# Altium schematic sheet Vapeix_mini_Shield.SchDoc: Vapeix Mini PCB - Interface
size A3; Organization: Altium Limited; Address1: L3, 12a Rodborough Rd; Address2: Frenchs Forest; Address3: NSW; Address4: Australia 2086; Revision: v2.0
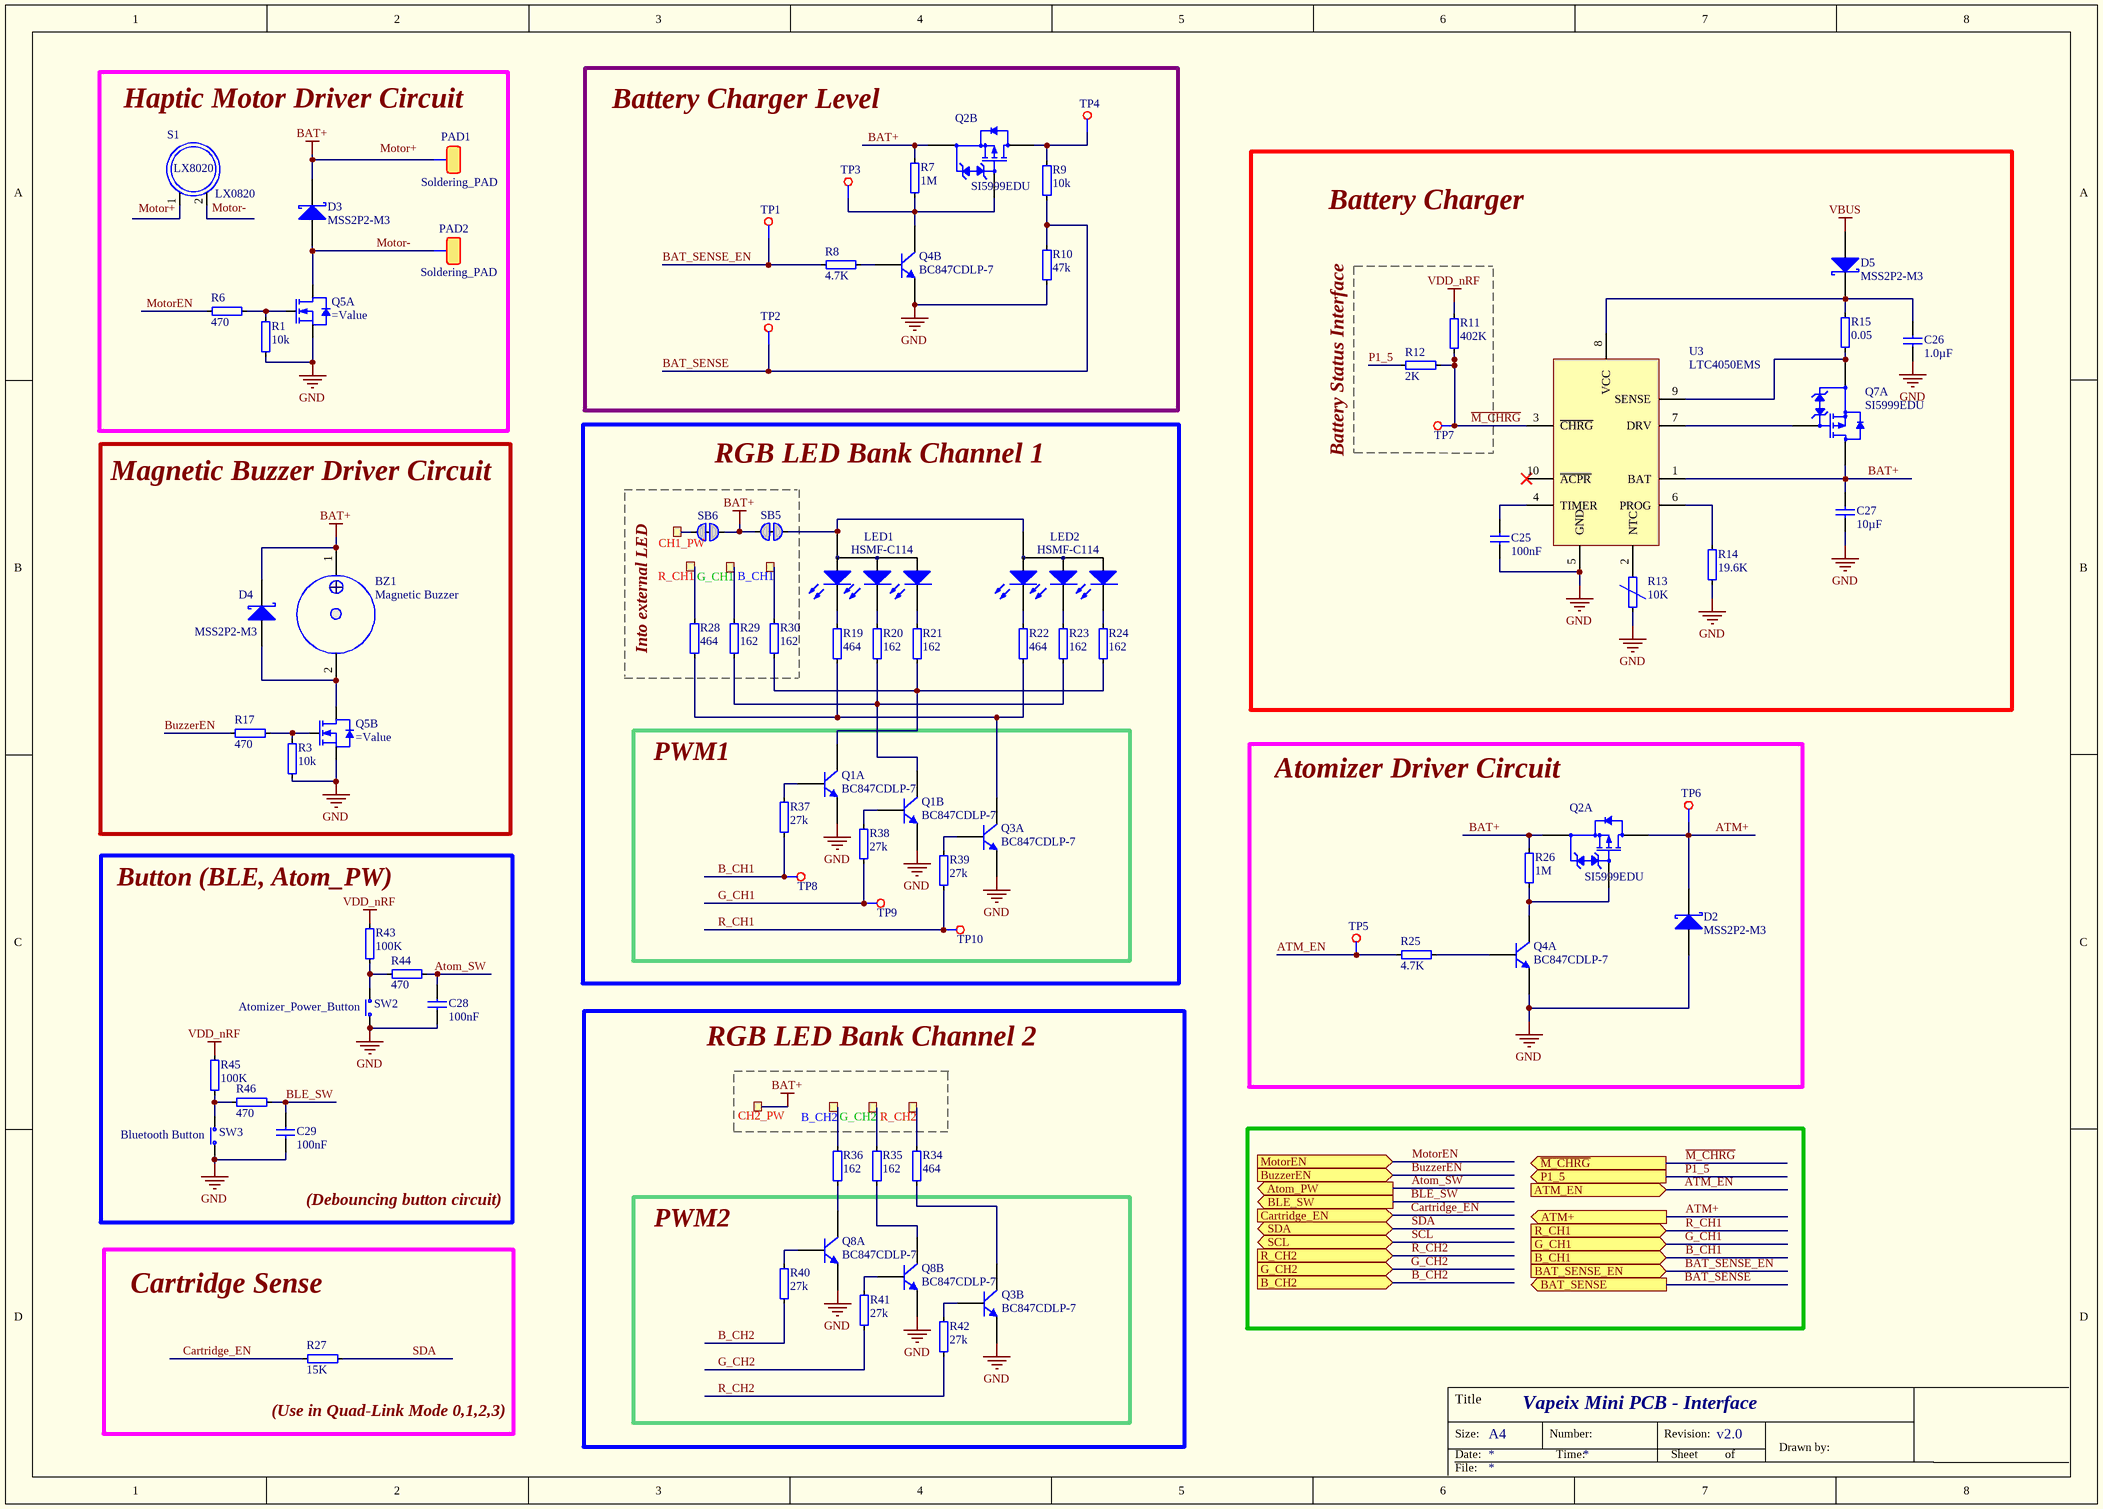
[diagram p0: Vapeix_mini_Shield.SchDoc]

## Parts
B_CH1  TP  [TESTPAD-TH]  (value not drawn)  (no BOM)
B_CH2  TP  [TESTPAD-TH]  (value not drawn)  (no BOM)
BZ1  Magnetic Buzzer  [Magnetic Buzzer]
C25  100nF  [C0201]
C26  1.0µF  [C0201]
C27  10µF  [R0402]
C28  100nF  [C0201]
C29  100nF  [C0201]
CH1_PW  TP  [TESTPAD-TH]  (value not drawn)  (no BOM)
CH2_PW  TP  [TESTPAD-TH]  (value not drawn)  (no BOM)
D2  MSS2P2-M3  [MSS2P2-M3]
D3  MSS2P2-M3  [MSS2P2-M3]
D4  MSS2P2-M3  [MSS2P2-M3]
D5  MSS2P2-M3  [MSS2P2-M3]
G_CH1  TP  [TESTPAD-TH]  (value not drawn)  (no BOM)
G_CH2  TP  [TESTPAD-TH]  (value not drawn)  (no BOM)
LED1  HSMF-C114  [HSMF-C114]
LED2  HSMF-C114  [HSMF-C114]
PAD1  Soldering_PAD  [Soldering_PAD]
PAD2  Soldering_PAD  [Soldering_PAD]
Q1  BC847CDLP-7  [BC847CDLP-7]  (parts A,B of 2)
Q2  SI5999EDU  [SI5999EDU]  (parts A,B of 2)
Q3  BC847CDLP-7  [BC847CDLP-7]  (parts A,B of 2)
Q4  BC847CDLP-7  [BC847CDLP-7]  (parts A,B of 2)
Q5  (no value)  [SOT363]  (parts A,B of 2)
Q7  SI5999EDU  [SI5999EDU]  (part A of 2)
Q8  BC847CDLP-7  [BC847CDLP-7]  (parts A,B of 2)
R1  10k  [R0201]
R3  10k  [R0201]
R6  470  [R0201]
R7  1M  [R0201]
R8  4.7K  [R0201]
R9  10k  [R0201]
R10  47k  [R0201]
R11  402K  [R0201]
R12  2K  [R0201]
R13  10K  [RL0503-5820-97-MS]
R14  19.6K  [R0201]
R15  0.05  [0805]
R17  470  [R0201]
R19  464  [R0201]
R20  162  [R0201]
R21  162  [R0201]
R22  464  [R0201]
R23  162  [R0201]
R24  162  [R0201]
R25  4.7K  [R0201]
R26  1M  [R0201]
R27  15K  [R0201]
R28  464  [R0201]
R29  162  [R0201]
R30  162  [R0201]
R34  464  [R0201]
R35  162  [R0201]
R36  162  [R0201]
R37  27k  [R0201]
R38  27k  [R0201]
R39  27k  [R0201]
R40  27k  [R0201]
R41  27k  [R0201]
R42  27k  [R0201]
R43  100K  [R0201]
R44  470  [R0201]
R45  100K  [R0201]
R46  470  [R0201]
R_CH1  TP  [TESTPAD-TH]  (value not drawn)  (no BOM)
R_CH2  TP  [TESTPAD-TH]  (value not drawn)  (no BOM)
S1  LX0820  [LX0820L20140926-01]
SB5  Solderbridge  [Solderbridge_Shorted]  (value not drawn)  (net tie, no BOM)
SB6  Solderbridge  [Solderbridge_Shorted]  (value not drawn)  (net tie, no BOM)
SW2  Atomizer_Power_Button  [ALPS_SKHUxxx010_WO_GND]
SW3  Bluetooth Button  [ALPS_SKHUxxx010_WO_GND]
TP1  TP  [TP]  (value not drawn)
TP2  TP  [TP]  (value not drawn)
TP3  TP  [TP]  (value not drawn)
TP4  TP  [TP]  (value not drawn)
TP5  TP  [TP]  (value not drawn)
TP6  TP  [TP]  (value not drawn)
TP7  TP  [TP]  (value not drawn)
TP8  TP  [TP]  (value not drawn)
TP9  TP  [TP]  (value not drawn)
TP10  TP  [TP]  (value not drawn)
U3  LTC4050EMS  [LTC4050EMS]

## Ports
ATM+ (out), ATM_EN (in), Atom_PW (out), B_CH1 (in), B_CH2 (in), BAT_SENSE (out), BAT_SENSE_EN (in), BLE_SW (out), BuzzerEN (in), Cartridge_EN (in), G_CH1 (in), G_CH2 (in), MotorEN (in), P1_5 (out), R_CH1 (in), R_CH2 (in), SCL (bidir), SDA (bidir), ~{M_CHRG} (out)

## Nets
BAT+: BZ1.1(P) C27.2 CH2_PW.1 D3.2(K) D4.2(K) PAD1.1(TP) Q2.1(S1) Q2.3(S2) Q7.7(D1) R7.2 R26.2 SB5.2 SB6.2 U3.1(BAT)
GND: C25.2 C26.1 C27.1 C28.2 C29.2 D2.1(A) Q1.1(E1) Q1.4(E2) Q3.1(E1) Q3.4(E2) Q4.1(E1) Q4.4(E2) Q5.1(S1) Q5.4(S2) Q8.1(E1) Q8.4(E2) R1.1 R3.1 R10.1 R13.2 R14.2 SW2.1(N.O) SW3.1(N.O) U3.5(GND)
VBUS: D5.1(A)
VDD_nRF: R11.1 R43.2 R45.2
ATM+: D2.2(K) Q2.7(D1) TP6.1(TP) ; port ATM+
ATM_EN: R25.2 TP5.1(TP) ; port ATM_EN
Atom_SW: C28.1 R44.1 ; port Atom_PW
B_CH1: R37.2 TP8.1(TP) ; port B_CH1
B_CH2: R40.2 ; port B_CH2
BAT_SENSE: R9.1 R10.2 TP2.1(TP) ; port BAT_SENSE
BAT_SENSE_EN: R8.2 TP1.1(TP) ; port BAT_SENSE_EN
BLE_SW: C29.1 R46.1 ; port BLE_SW
BuzzerEN: R17.2 ; port BuzzerEN
Cartridge_EN: R27.2 ; port Cartridge_EN
G_CH1: R38.2 TP9.1(TP) ; port G_CH1
G_CH2: R41.2 ; port G_CH2
~{M_CHRG}: R11.2 R12.2 TP7.1(TP) U3.3(~{CHRG}) ; port ~{M_CHRG}
Motor-: D3.1(A) PAD2.1(TP) Q5.6(D1)
MotorEN: R6.2 ; port MotorEN
P1_5: R12.1 ; port P1_5
R_CH1: R39.2 TP10.1(TP) ; port R_CH1
R_CH2: R42.2 ; port R_CH2
SCL: port SCL
SDA: R27.1 ; port SDA
NetB_CH1_1: B_CH1.1 R30.1
NetB_CH2_1: B_CH2.1 R36.1
NetBZ1_2: BZ1.2(M) D4.1(A) Q5.3(D2)
NetC25_1: C25.1 U3.4(TIMER)
NetC26_2: C26.2 D5.2(K) R15.1 U3.8(VCC)
NetCH1_PW_1: CH1_PW.1 SB6.1
NetG_CH1_1: G_CH1.1 R29.1
NetG_CH2_1: G_CH2.1 R35.1
NetLED1_1: LED1.1(ANODE) LED2.1(ANODE) SB5.1
NetLED1_2: LED1.2(RED) R19.1
NetLED1_3: LED1.3(GREEN) R20.1
NetLED1_4: LED1.4(BLUE) R21.1
NetLED2_2: LED2.2(RED) R22.1
NetLED2_3: LED2.3(GREEN) R23.1
NetLED2_4: LED2.4(BLUE) R24.1
NetQ1_2: Q1.2(B1) R37.1
NetQ1_3: Q1.3(C1) R21.2 R24.2 R30.2
NetQ1_5: Q1.5(B2) R38.1
NetQ1_6: Q1.6(C2) R20.2 R23.2 R29.2
NetQ2_2: Q2.2(G1) Q4.3(C1) R26.1
NetQ2_4: Q2.4(G2) Q4.6(C2) R7.1 TP3.1(TP)
NetQ2_5: Q2.5(D2) R9.2 TP4.1(TP)
NetQ3_2: Q3.2(B1) R39.1
NetQ3_3: Q3.3(C1) R19.2 R22.2 R28.2
NetQ3_5: Q3.5(B2) R42.1
NetQ3_6: Q3.6(C2) R34.2
NetQ4_2: Q4.2(B1) R25.1
NetQ4_5: Q4.5(B2) R8.1
NetQ5_2: Q5.2(G1) R1.2 R6.1
NetQ5_5: Q5.5(G2) R3.2 R17.1
NetQ7_1: Q7.1(S1) R15.2 U3.9(SENSE)
NetQ7_2: Q7.2(G1) U3.7(DRV)
NetQ8_2: Q8.2(B1) R40.1
NetQ8_3: Q8.3(C1) R36.2
NetQ8_5: Q8.5(B2) R41.1
NetQ8_6: Q8.6(C2) R35.2
NetR13_1: R13.1 U3.2(NTC)
NetR14_1: R14.1 U3.6(PROG)
NetR28_1: R28.1 R_CH1.1
NetR34_1: R34.1 R_CH2.1
NetR43_1: R43.1 R44.2 SW2.2(COM)
NetR45_1: R45.1 R46.2 SW3.2(COM)

Not connected (* = marked no-connect by the designer): S1 1(PW) 2(GND); U3 10(~{ACPR})*

## Notes on the sheet
- Labels drawn without touching a wire or pin: (Debouncing button circuit), (Use in Quad-Link Mode 0,1,2,3), Atomizer Driver Circuit, Battery Charger, Battery Charger Level, Battery Status Interface, Button (BLE, Atom_PW), Cartridge Sense, Haptic Motor Driver Circuit, Into external LED, Magnetic Buzzer Driver Circuit, Motor+, Motor-, PWM1, PWM2, RGB LED Bank Channel 1, RGB LED Bank Channel 2
- Title
- Size:
- Date:
- A4
- Number:
- Time:
- Revision:
- Sheet
- of
- Drawn by:
- File:
- (in symbol LX0820) LX8020

## Library data of the parts
B_CH1 B_CH2 CH1_PW CH2_PW G_CH1 G_CH2 R_CH1 R_CH2 = TESTPAD_TH: Testpoint, through hole; Part Number: Testpoint TH; Artikkelnr Noca: N.A.; Manufacturer: *; Manufacturer Part Number: *; Datasheet: *; Footprint Doc: TESTPAD-TH; LatestRevisionDate: 2009-12-12; Pin Count: 1; Publisher: Nordic Semiconductor; Published: 2009-12-12; Value: TP; Note: *; Supplier: *; Supplier part number: *; 2nd source Supplier: *; 2nd source part number: *; Artikkelnr Simpro: N.A.
BZ1 = Magnetic Buzzer: Audio Indicators & Alerts 6.7 x 3.6mm 3100Hz; Manufacturer: Kobitone; Manufacturer Part Number: 254-EMB73-RO; Supplier: Mouser; Supplier part number: 254-EMB73-RO
C25 C28 C29 = C0402-100n: CAP CER 0.1UF 10V X5R 0201; Manufacturer: Murata Electronics North America; Manufacturer Part Number: GRM033R61A104KE15D; Note: 16V; Artikkelnr Noca: 20039200; Artikkelnr Simpro: N.A.; Part Number: C0402-100n; Datasheet: *; LatestRevisionDate: 2009-11-23; Pin Count: 2; Publisher: Nordic Semiconductor; Published: 2009-05-08; Value: 100nF; Supplier: Digi-Key; Supplier part number: 490-5881-1-ND; 2nd source Supplier: *; 2nd source part number: *; Footprint Doc: 0201
C26 = C0603-1µ0: CAP CER 1UF 16V X5R 0201; Manufacturer: Samsung Electro-Mechanics America, Inc.; Manufacturer Part Number: CL03A105MO3NRNH; Pin Count: 2; Value: 1.0µF; Supplier: Digi-Key; Supplier part number: 1276-6798-1-ND; 2nd source Supplier: *; 2nd source part number: *
C27 = C0603-10µ: CAP CER 10UF 10V X5R 0402; Manufacturer: Samsung Electro-Mechanics America, Inc.; Manufacturer Part Number: CL05A106MP5NUNC; Note: 6.3V; Artikkelnr Noca: 20039234; Artikkelnr Simpro: N.A.; Datasheet: *; LatestRevisionDate: 2011-01-17; Pin Count: 2; Publisher: Nordic Semiconductor; Published: 2011-01-17; Value: 10µF; Supplier: Digi-Key; Supplier part number: 1276-1450-2-ND; 2nd source Supplier: *; 2nd source part number: *; Footprint Doc: 0402
D2-D5 = MSS2P2-M3/89A: DIODE SCHOTTKY 20V 2A MICROSMP; Manufacturer: Vishay Semiconductor Diodes Division; Voltage - Forward (Vf) (Max) @ If: 600mV @ 2A; Speed: Fast Recovery =< 500ns, > 200mA (Io); Current - Reverse Leakage @ Vr: 250µA @ 20V; Capacitance @ Vr, F: 65pF @ 4V, 1MHz; Supplier 1: Digi-Key; Manufacturer Part Number: MSS2P2-M3/89A; RoHS: RoHS Compliant; Category: Discrete Semiconductor Products; Stock 1: 3961; Pricing 1: 1=0.37, 10=0.274, 100=0.1552, 500=0.1029, 1000=0.07892 (USD); Packaging: Digi-Reel®; Diode Type: Schottky; Voltage - DC Reverse (Vr) (Max): 20V; Current - Average Rectified (Io): 2A; Reverse Recovery Time (trr): -; Mounting Type: Surface Mount; Package / Case: MicroSMP; Supplier Device Package: MicroSMP; Operating Temperature - Junction: -55°C ~ 150°C; ComponentLink1URL: http://www.vishay.com/docs/89054/mss2p3.pdf; ComponentLink1Description: http://www.vishay.com/docs/89054/mss2p3.pdf
LED1 LED2 = HSMF-C114: LED RGB DIFFUSED 0606 SMD; Manufacturer: Broadcom Limited; Color: Red, Green, Blue (RGB); Lens Color: White; Millicandela Rating: 85mcd Red, 180mcd Green, 70mcd Blue; Lens Style/Size: Rectangle with Flat Top, 1.10mm x 1.50mm; Voltage - Forward (Vf) (Typ): 1.9V Red, 3.4V Green, 3.4V Blue; Current - Test: 20mA Red, 20mA Green, 20mA Blue; Viewing Angle: 140° Red, 145° Green, 145° Blue; Wavelength - Dominant: 626nm Red, 525nm Green, 470nm Blue; Wavelength - Peak: 637nm Red, 523nm Green, 468nm Blue; Supplier 1: Digi-Key; Manufacturer Part Number: HSMF-C114; RoHS: RoHS Compliant; Category: Optoelectronics; Stock 1: 11787; Pricing 1: 1=2.03, 10=1.62, 25=1.2376, 100=1.125, 250=0.99, 500=0.8325, 1000=0.72 (USD); Packaging: Digi-Reel®; Lens Transparency: Diffused; Mounting Type: Surface Mount; Features: -; Package / Case: 0606 (1616 Metric); Supplier Device Package: Chip LED; Size / Dimension: 1.60mm L x 1.50mm W; Height (Max): 0.35mm; ComponentLink1URL: http://www.avagotech.com/docs/AV02-2451EN; ComponentLink1Description: http://www.avagotech.com/docs/AV02-2451EN
PAD1 PAD2 = Soldering_PAD: Soldering PAD
Q1 Q3 Q4 Q8 = BC847CDLP-7: TRANS 2NPN 45V 0.1A 6DFN; Manufacturer: Diodes Incorporated; Transistor Type: 2 NPN (Dual); Current - Collector (Ic) (Max): 100mA; Vce Saturation (Max) @ Ib, Ic: 600mV @ 5mA, 100mA; Current - Collector Cutoff (Max): 15nA; DC Current Gain (hFE) (Min) @ Ic, Vce: 420 @ 2mA, 5V; Power - Max: 350mW; Frequency - Transition: 100MHz; Supplier 1: Digi-Key; Manufacturer Part Number: BC847CDLP-7; RoHS: RoHS Compliant; Category: Discrete Semiconductor Products; Stock 1: 11845; Pricing 1: 1=0.36, 10=0.29, 100=0.198, 500=0.1482, 1000=0.111 (USD); Packaging: Cut Tape (CT); Voltage - Collector Emitter Breakdown (Max): 45V; Mounting Type: Surface Mount; Package / Case: 6-SMD, No Lead; Supplier Device Package: 6-DFN1310H4 (1.0x1.3); ComponentLink1URL: http://www.diodes.com/_files/datasheets/ds30817.pdf; ComponentLink1Description: http://www.diodes.com/_files/datasheets/ds30817.pdf
Q2 Q7 = SI5999EDU-T1-GE3: MOSFET 2P-CH 20V 6A POWERPAK; Manufacturer: Vishay Siliconix; FET Type: 2 P-Channel (Dual); FET Feature: Logic Level Gate; Rds On (Max) @ Id, Vgs: 59 mOhm @ 3.5A, 4.5V; Vgs(th) (Max) @ Id: 1.5V @ 250µA; Gate Charge (Qg) @ Vgs: 20nC @ 10V; Input Capacitance (Ciss) @ Vds: 496pF @ 10V; Power - Max: 10.4W; Supplier 1: Digi-Key; Manufacturer Part Number: SI5999EDU-T1-GE3; RoHS: RoHS Compliant; Category: Discrete Semiconductor Products; Stock 1: 2994; Pricing 1: 1=0.58, 10=0.51, 100=0.39, 500=0.309, 1000=0.2475 (USD); Packaging: Cut Tape (CT); Drain to Source Voltage (Vdss): 20V; Current - Continuous Drain (Id) @ 25°C: 6A; Operating Temperature: -55°C ~ 150°C (TJ); Mounting Type: Surface Mount; Package / Case: PowerPAK® ChipFET™ Dual; Supplier Device Package: PowerPAK® ChipFet Dual; ComponentLink1URL: http://www.vishay.com/docs/67019/si5999ed.pdf; ComponentLink1Description: http://www.vishay.com/docs/67019/si5999ed.pdf
Q5 = MOSFET_N_DUAL: MOSFET 2N-CH 30V 1A SOT363; Manufacturer: Diodes Incorporated; Manufacturer Part Number: DMN3190LDW-13; Supplier: Digi-Key; Supplier part number: DMN3190LDW-13DICT-ND
R1 R3 R9 = R0402-10k: RES SMD 10K OHM 1% 1/20W 0201; Manufacturer: Panasonic Electronic Components; Manufacturer Part Number: ERJ-1GEF1002C; Note: Chip Res 1%; Footprint Doc: 0201; Pin Count: 2; Value: 10k; Supplier: Digi-Key; Supplier part number: P10.0KABCT-ND
R6 R17 R44 R46 = R0402-10k: RES SMD 470 OHM 5% 1/20W 0201; Manufacturer: Yageo; Manufacturer Part Number: RC0201JR-07470RL; Value: 470; Supplier: Digi-Key; Supplier part number: 311-470NCT-ND; 2nd source Supplier: *; 2nd source part number: *
R7 R26 = R0402-10k: RES SMD 1M OHM 5% 1/20W 0201; Manufacturer: Yageo; Manufacturer Part Number: RC0201JR-071ML; Value: 1M; Supplier: Digi-Key; Supplier part number: 311-1MNCT-ND
R8 R25 = R0402-10k: RES SMD 4.7K OHM 1% 1/20W 0201; Manufacturer: Panasonic Electronic Components; Manufacturer Part Number: ERJ-1GEF4701C; Value: 4.7K; Supplier: Digi-Key; Supplier part number: P4.70KABCT-ND
R10 = R0402-10k: RES SMD 47K OHM 1% 1/20W 0201; Manufacturer: Panasonic Electronic Components; Manufacturer Part Number: ERJ-1GEF4702C; Note: Chip Res 1%; Footprint Doc: 0201; Pin Count: 2; Value: 47k; Supplier: Digi-Key; Supplier part number: P47.0KABCT-ND
R11 = R0402-10k: RES SMD 402K OHM 1% 1/20W 0201; Manufacturer: Yageo; Manufacturer Part Number: RC0201FR-07402KL; Value: 402K; Datasheet: *; Supplier: Digi-Key; Supplier part number: YAG2657CT-ND; 2nd source Supplier: *; 2nd source part number: *
R12 = R0402-10k: RES SMD 2K OHM 5% 1/20W 0201; Manufacturer: Yageo; Manufacturer Part Number: RC0201JR-072KL; Value: 2K; Supplier: Digi-Key; Supplier part number: 311-2KNCT-ND; 2nd source Supplier: *; 2nd source part number: *
R13 = RL0503-5820-97-MS: THERMISTOR MINI-SENS NTC 10K OHM; Manufacturer: Stackpole Electronics Inc.; Resistance Tolerance: ±1%; Supplier 1: Digi-Key; Manufacturer Part Number: RL0503-5820-97-MS; RoHS: RoHS Compliant; Category: Sensors, Transducers; Stock 1: 14949; Pricing 1: 1=2.39, 5=2.258, 10=1.935, 25=1.548, 50=1.419, 100=1.29, 250=1.19324, 500=1.12876, 1000=0.99975 (USD); Packaging: Bulk; Resistance in Ohms @ 25°C: 10k; B Value Tolerance: -; B0/50: -; B25/50: -; B25/75: -; B25/85: -; B25/100: -; Operating Temperature: -50°C ~ 150°C; Power - Max: -; Length - Lead Wire: -; Mounting Type: Free Hanging; Package / Case: Bead; ComponentLink1URL: http://www.amphenol-sensors.com/index.php?option=com_edocman&task=document.download&id=104; ComponentLink1Description: http://www.amphenol-sensors.com/index.php?option=com_edocman&task=document.download&id=104
R14 = R0402-10k: RES SMD 19.6K OHM 1% 1/20W 0201; Manufacturer: Panasonic Electronic Components; Manufacturer Part Number: ERJ-1GEF1962C; Note: Chip Res 1%; Value: 19.6K; Datasheet: *; Supplier: Digi-Key; Supplier part number: P19.6KABCT-ND; 2nd source Supplier: *; 2nd source part number: *
R15 = R0402-10k: RES SMD 0.05 OHM 1% 1/4W 0805; Manufacturer: Panasonic Electronic Components; Manufacturer Part Number: ERJ-L06KF50MV; Value: 0.05; Supplier: Digi-Key; Supplier part number: P50LLCT-ND; 2nd source Supplier: *; 2nd source part number: *
R19 R22 R28 R34 = R0402-10k: RES SMD 464 OHM 1% 1/20W 0201; Manufacturer: Panasonic Electronic Components; Manufacturer Part Number: ERJ-1GEF4640C; Value: 464; Supplier: Digi-Key; Supplier part number: P464ABCT-ND
R20 R21 R23 R24 R29 R30 R35 R36 = R0402-10k: RES SMD 162 OHM 1% 1/20W 0201; Manufacturer: Yageo; Manufacturer Part Number: RC0201FR-07162RL; Value: 162; Supplier: Digi-Key; Supplier part number: YAG2429CT-ND
R27 = R0402-10k: RES SMD 15K OHM 5% 1/20W 0201; Manufacturer: Panasonic Electronic Components; Manufacturer Part Number: ERJ-1GEJ153C; Note: Chip Res 1%; Artikkelnr Noca: 27049097; Artikkelnr Simpro: N.A.; Value: 15K; Part Number: R0402-10k; Datasheet: *; LatestRevisionDate: 2009-11-23; Pin Count: 2; Publisher: Nordic Semiconductor; Published: 2009-05-08; Supplier: Digi-Key; Supplier part number: P15KAGCT-ND; 2nd source Supplier: *; 2nd source part number: *; Footprint Doc: 0402
R37-R42 = R0402-10k: RES SMD 27K OHM 5% 1/20W 0201; Manufacturer: Panasonic Electronic Components; Manufacturer Part Number: ERJ-1GEJ273C; Value: 27k; Supplier: Digi-Key; Supplier part number: P27KAGCT-ND
R43 R45 = R0402-10k: RES SMD 100K OHM 5% 1/20W 0201; Manufacturer: Yageo; Manufacturer Part Number: RC0201JR-07100KL; Value: 100K; Datasheet: *; Pin Count: 2; Supplier: DIgi-Key; Supplier part number: 311-100KNCT-ND; 2nd source Supplier: *; 2nd source part number: *
S1 = LX0820: LX0820L20140926-01
SB5 SB6 = Solderbridge Shorted: Shorted Solderbridge; Artikkelnr Noca: N.A.; Part Number: Solderbridge Shorted; Manufacturer: *; Manufacturer Part Number: *; Datasheet: *; LatestRevisionDate: 2012-08-07; Pin Count: 2; Publisher: Nordic Semiconductor; Published: 2012-08-07; Value: Solderbridge; Note: *; Supplier: *; Supplier part number: *; 2nd source Supplier: *; 2nd source part number: *; Footprint Doc: Solderbridge_Shorted; Artikkelnr Simpro: N.A.
SW2 SW3 = ALPS_SKHUALE010: ALPS - SKHUALE010 - Tactile Switch, SPNO, SMD, 6.5x6.2x2.5mm; 2nd source part number: 688-SKHUALE010; Value: RST SW; Artikkelnr Noca: 50019001; Artikkelnr Simpro: N.A.; Part Number: ALPS_SKHUALE010; Manufacturer: Alps; Manufacturer Part Number: SKHUALE010; Datasheet: https://www1.elfa.se/data1/wwwroot/webroot/Z_DATA/03579000.pdf; LatestRevisionDate: 2010-02-01; Pin Count: 4; Publisher: Nordic Semiconductor; Published: 2010-02-01; Note: *; Supplier: Mouser; Supplier part number: 688-SKHUALE010; 2nd source Supplier: Mouser; Footprint Doc: ALPS_SKHUxxx010_WO_GND
TP1-TP10 = TP: TEST POINT
U3 = LTC4050EMS-4.1#PBF: IC BATT CHRG CNTRL LI-ION 10MSOP; Manufacturer: Linear Technology; Manufacturer Part Number: LTC4050EMS-4.2#PBF; Function: Charge Management; Voltage - Supply: 4.5 V ~ 10 V; Supplier 1: Digi-Key; RoHS: RoHS Compliant; Category: Integrated Circuits (ICs); Stock 1: 1327; Pricing 1: 1=4.77, 25=3.1696, 100=2.3869 (USD); Packaging: Tube; Battery Chemistry: Li-Ion; Operating Temperature: -40°C ~ 85°C; Mounting Type: Surface Mount; Package / Case: 10-TFSOP, 10-MSOP (0.118", 3.00mm Width); Supplier Device Package: 10-MSOP; ComponentLink1URL: http://www.linear.com/docs/3321; ComponentLink1Description: http://www.linear.com/docs/3321